# Altium schematic sheet pagerv2IO.SchDoc
size A4; SheetNumber: 2; SheetTotal: 2
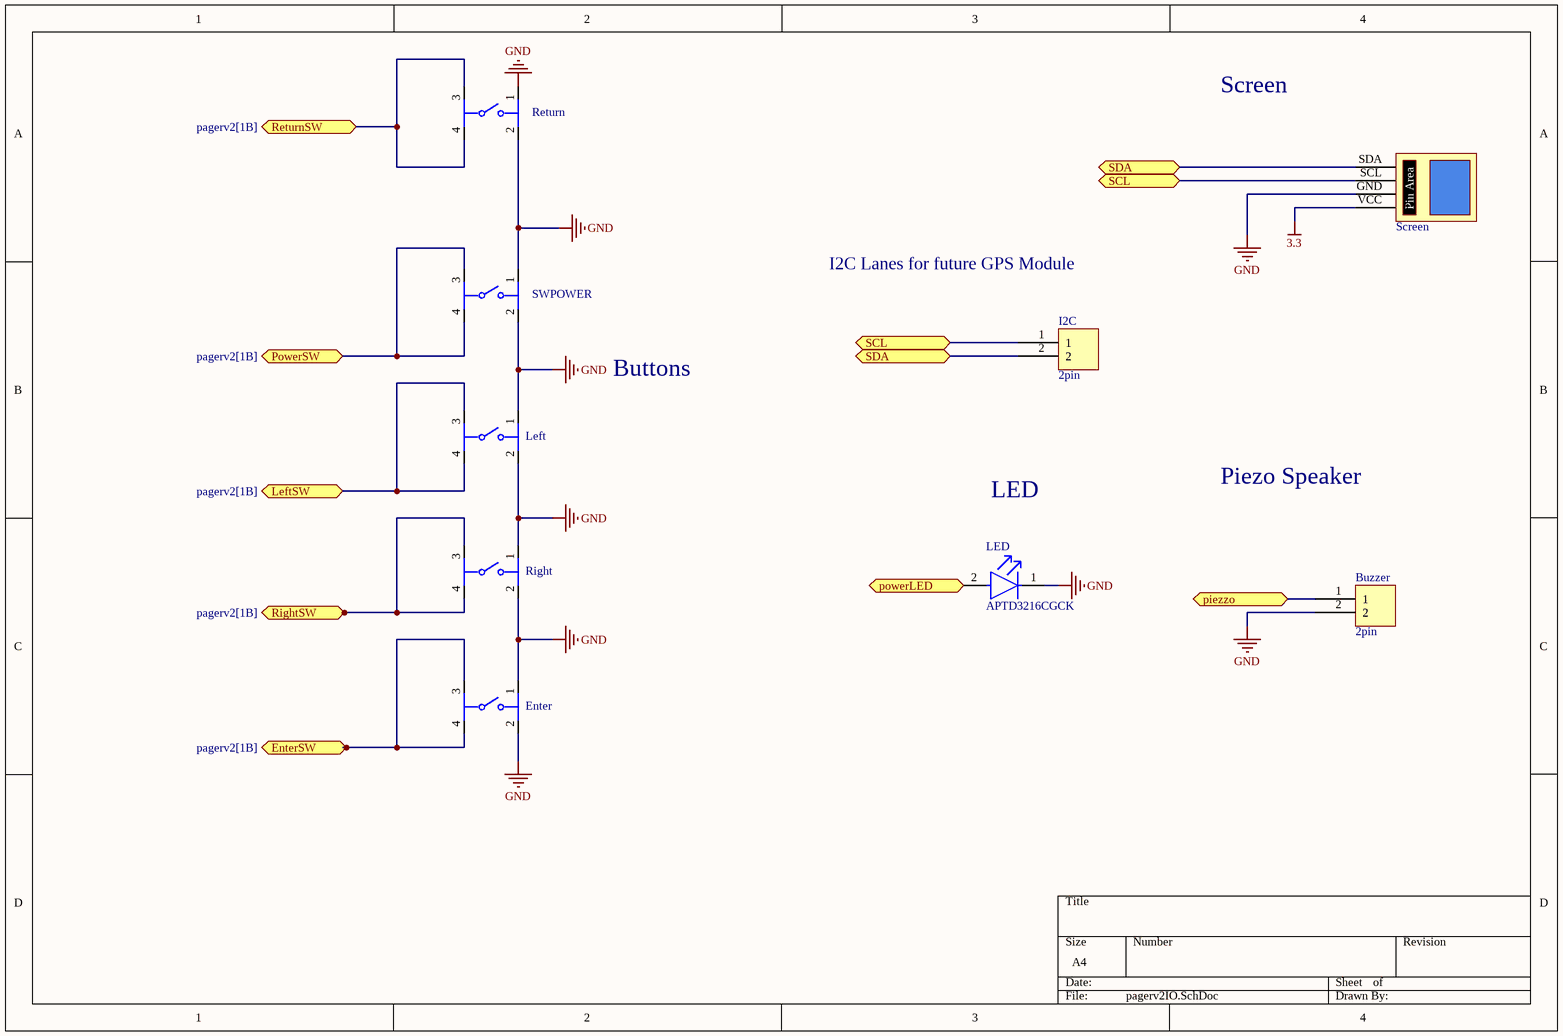
[diagram p0: pagerv2IO.SchDoc]

## Parts
?  Screen  [Screen]
Buzzer  2pin  [2PIN]
Enter  PTS645SH50SMTR92LFS  [FP-PTS645SH50SMTR92LFS-MFG]  (value not drawn)
I2C  2pin  [2PIN]
LED  APTD3216CGCK  [FP-APTD3216CGCK-MFG]
Left  PTS645SH50SMTR92LFS  [FP-PTS645SH50SMTR92LFS-MFG]  (value not drawn)
Return  PTS645SH50SMTR92LFS  [FP-PTS645SH50SMTR92LFS-MFG]  (value not drawn)
Right  PTS645SH50SMTR92LFS  [FP-PTS645SH50SMTR92LFS-MFG]  (value not drawn)
SWPOWER  PTS645SH50SMTR92LFS  [FP-PTS645SH50SMTR92LFS-MFG]  (value not drawn)

## Ports
EnterSW (bidir, see pagerv2[1B]), LeftSW (bidir, see pagerv2[1B]), piezzo (bidir, see pagerv2[2B]), powerLED (bidir, see pagerv2[1B]), PowerSW (bidir, see pagerv2[1B]), ReturnSW (bidir, see pagerv2[1B]), RightSW (bidir, see pagerv2[1B]), SCL (bidir, see pagerv2[2B], pagerv2IO[3A]), SCL (bidir, see pagerv2[2B], pagerv2IO[3B]), SDA (bidir, see pagerv2[2B], pagerv2IO[3A]), SDA (bidir, see pagerv2[2B], pagerv2IO[3B])

## Nets
3.3: ?.VCC(4)
GND: ?.GND(3) Buzzer.2 Enter.1 Enter.2 LED.1(C) Left.1 Left.2 Return.1 Return.2 Right.1 Right.2 SWPOWER.1 SWPOWER.2
EnterSW: Enter.3 Enter.4 ; port EnterSW
LeftSW: Left.3 Left.4 ; port LeftSW
piezzo: Buzzer.1 ; port piezzo
powerLED: LED.2(A) ; port powerLED
PowerSW: SWPOWER.3 SWPOWER.4 ; port PowerSW
ReturnSW: Return.3 Return.4 ; port ReturnSW
RightSW: Right.3 Right.4 ; port RightSW
SCL: ?.SCL(2) I2C.1 ; port SCL
SDA: ?.SDA(1) I2C.2 ; port SDA

## Notes on the sheet
- Screen
- I2C Lanes for future GPS Module
- Buttons
- LED
- Piezo Speaker
- (in symbol Screen) Pin Area

## Library data of the parts
Enter Left Return Right SWPOWER = CMP-10040-000028-1: SWITCH TACTILE SPST-NO 0.05A 12V; Operating Force: 200gf; Current Rating: 50mA; Illumination Type: Non-Illuminated; Actuator Material: Nylon; Throw Configuration: SPST; Switch Function: Off-Mom; Mechanical Life: 100000Cycles; Actuator Type: Standard; Packaging: Tape and Reel; Termination: Gull Wing; Max Operating Temperature: 60°C; Length: 6mm; REACH SVHC: No SVHC; Orientation: Straight; Max Voltage Rating (DC): 12V; Package Quantity: 1000; Max Current Rating: 50mA; Mount: Surface Mount; Contact Material: Bronze; Case/Package: SMD/SMT; Lead Free: Lead Free; Min Operating Temperature: -20°C; Contact Plating: Silver; Color: Black; Depth: 9mm; Voltage Rating (DC): 12V
LED = CMP-2000-05792-2: LED GREEN CLEAR 2SMD; Forward Voltage: 2.1V; Forward Current: 20mA; Luminous Intensity: 300mcd; Number of LEDs: 1; Dominant Wavelength: 570nm; Viewing Angle: 50°; Lead Free: Lead Free; Lens Color: Clear; Mount: Surface Mount; Package Quantity: 2000; Height: 1.8mm; Number of Pins: 2; Test Current: 20mA; Case Code (Metric): 3216; Case/Package: 1206; Case Code (Imperial): 1206; Illumination Color: Green; Color: Green; Width: 1.6mm; Packaging: Tape and Reel; Min Operating Temperature: -40°C; Lens Style: Clear; Max Operating Temperature: 85°C; Length: 3.2mm